# Altium schematic sheet IO.SchDoc
size A4; SheetNumber: 2; SheetTotal: 7
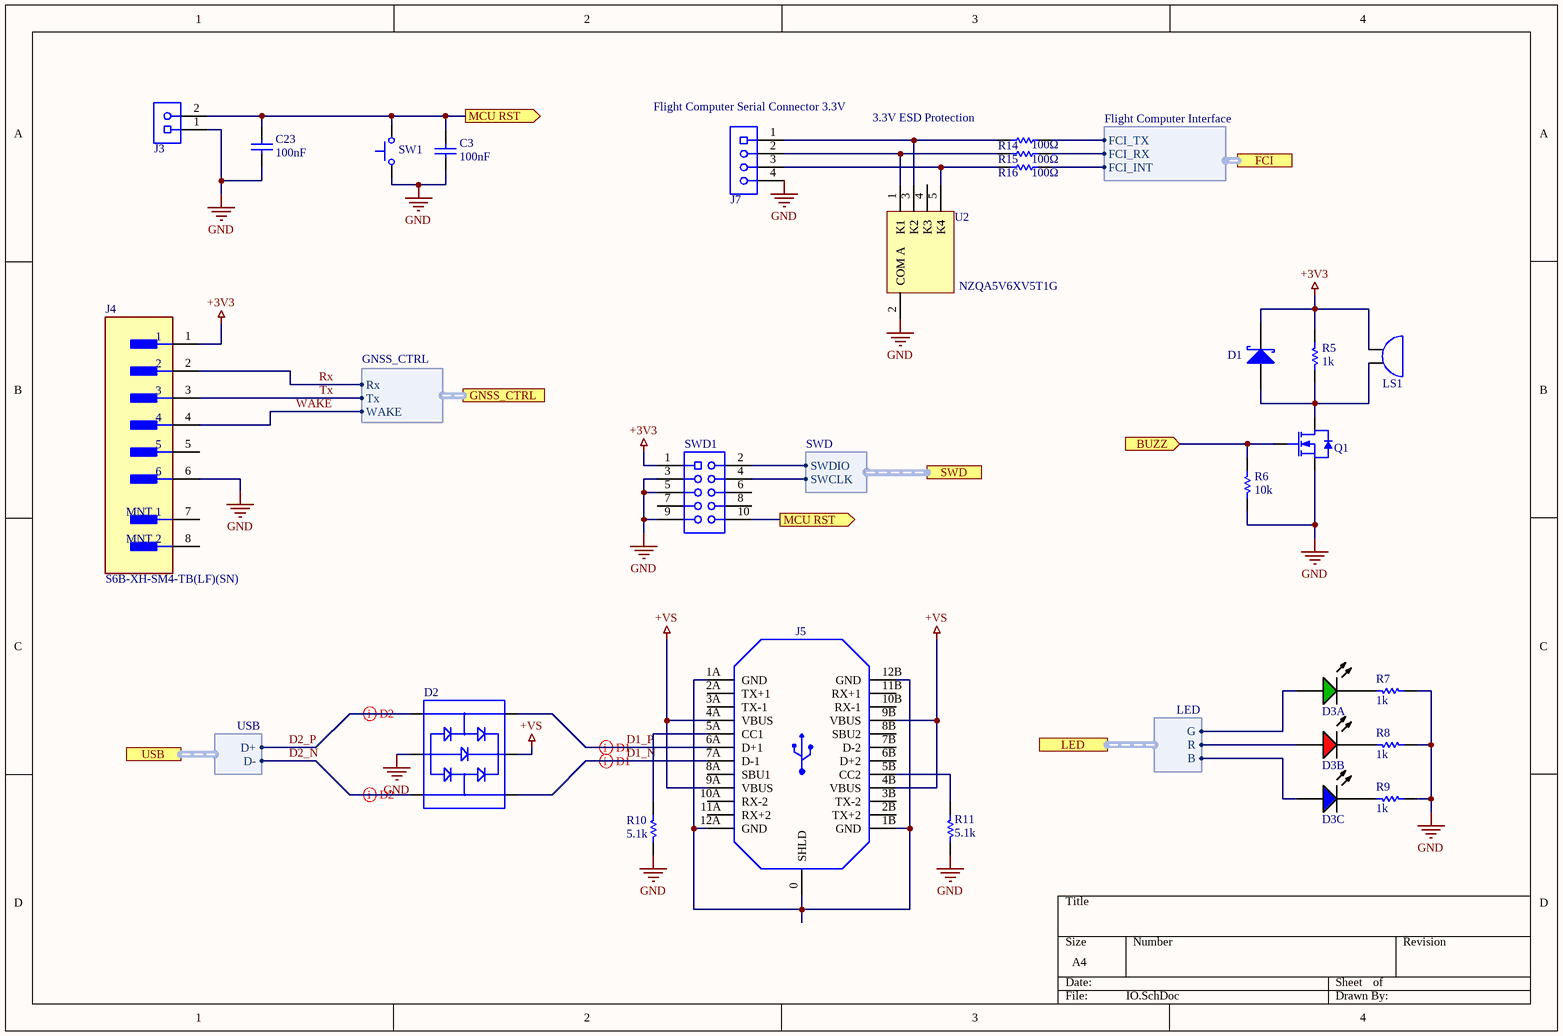
[diagram p0: IO.SchDoc]

## Parts
C3  value 100nF  [CAPC1608X10N]  (hidden comment: C0603C104M5RACTU)
C23  value 100nF  [CAPC1608X10N]  (hidden comment: C0603C104M5RACTU)
D1  RB521S30T1G  [SODFL160X70-2N]  (value not drawn)
D2  USBLC6-2SC6  [USBLC6-2SC6-Footprint-1]  (value not drawn)
D3  LRTBGVSR-U4V2-JW+A6BB-D8+S2U2-7Z-20-S  [LRTBGVSG-UEVE-24+AMAQ-29+SCUC-HR-Footprint-1]  (value not drawn)  (parts A,B,C of 3)
J3  22-28-4020  [22-28-4020-Footprint-1]  (value not drawn)
J4  S6B-XH-SM4-TB(LF)(SN)  [FP-S6B-XH-SM4-TB_LF_SN-MFG]
J5  SS-52400-003  [SS-52400-003-Footprint-1]  (value not drawn)
J7  53426-0410  [53426-0410-Footprint-1]  (value not drawn)
LS1  CMT-8503-85B-SMT-TR  [CMT-8503-85B-SMT-TR-Footprint-1]  (value not drawn)
Q1  2N7002NXAKR  [SOT95P230X110-3N]  (value not drawn)
R5  value 1k  [RESC1608X06N]  (hidden comment: CRCW06031K00FKEA)
R6  value 10k  [RESC1608X06N]  (hidden comment: CRCW060310K0FKEA)
R7  value 1k  [RESC1608X06N]  (hidden comment: CRCW06031K00FKEA)
R8  value 1k  [RESC1608X06N]  (hidden comment: CRCW06031K00FKEA)
R9  value 1k  [RESC1608X06N]  (hidden comment: CRCW06031K00FKEA)
R10  value 5.1k  [RESC1608X06N]  (hidden comment: CRCW06035K10FKEA)
R11  value 5.1k  [RESC1608X06N]  (hidden comment: CRCW06035K10FKEA)
R14  100Ω  [RESC1609X50X30ML8T20]
R15  100Ω  [RESC1609X50X30ML8T20]
R16  100Ω  [RESC1609X50X30ML8T20]
SW1  B3U-1000P  [OMRON-B3U-1000_V]  (value not drawn)
SWD1  M22-2520505  [M22-2520505-Footprint-1]  (value not drawn)
U2  NZQA5V6XV5T1G  [ONSC-SOT-553-5-463B_B_V]

## Ports
BUZZ (in, see Top Level[4C], Flight_Computer[3C]), FCI (harness Flight Computer Interface, see Top Level[4C], Flight_Computer[4C]), GNSS_CTRL (harness GNSS_CTRL, see Top Level[4D], Flight_Computer[1B]), LED (harness LED, see Top Level[4C], Flight_Computer[4A]), MCU RST (out, see Top Level[4C], Flight_Computer[2B]), SWD (harness SWD, see Top Level[4B], Flight_Computer[3B]), USB (harness USB, see Top Level[4C], Flight_Computer[3C])

## Harnesses
USB: D+, D-
SWD: SWDIO, SWCLK
LED: R, G, B
Flight Computer Interface: FCI_TX, FCI_RX, FCI_INT
GNSS_CTRL: Rx, Tx, WAKE

## Nets
+3V3: D1.1(K) J4.1 LS1.1 R5.2 SWD1.1(VDD)
+VS: D2.5 J5.4A(VBUS) J5.4B(VBUS) J5.9A(VBUS) J5.9B(VBUS)
GND: C3.1 C23.1 D2.2 J3.1 J4.6 J7.4 Q1.2(S) R6.1 R7.2 R8.2 R9.2 R10.1 R11.1 SW1.2 SWD1.3(GND) SWD1.5(GND) SWD1.9(GND) U2.2(COM_A)
BUZZ: Q1.1(G) R6.2 ; port BUZZ
D1_N: D2.6 J5.7A(D-1)
D1_P: D2.4 J5.6A(D+1)
D2_N: D2.1 ; port USB.D-
D2_P: D2.3 ; port USB.D+
MCU RST: C3.2 C23.2 J3.2 SW1.1 SWD1.10(NRST) ; port MCU RST
Rx: J4.2 ; port GNSS_CTRL.Rx
Tx: J4.3 ; port GNSS_CTRL.Tx
WAKE: J4.4 ; port GNSS_CTRL.WAKE
NetD1_2: D1.2(A) LS1.2 Q1.3(D) R5.1
NetD3_1: D3.1(K1) R7.1
NetD3_2: D3.2(A3) ; port LED.B
NetD3_3: D3.3(K3) R9.1
NetD3_4: D3.4(K2) R8.1
NetD3_5: D3.5(A2) ; port LED.R
NetD3_6: D3.6(A1) ; port LED.G
NetJ5_0: J5.0(SHLD) J5.1A(GND) J5.1B(GND) J5.12A(GND) J5.12B(GND)
NetJ5_5A: J5.5A(CC1) R10.2
NetJ5_5B: J5.5B(CC2) R11.2
NetJ7_1: J7.1 R14.2 U2.3(K2)
NetJ7_2: J7.2 R15.2 U2.1(K1)
NetJ7_3: J7.3 R16.2 U2.5(K4)
NetR14_1: R14.1 ; port FCI.FCI_TX
NetR15_1: R15.1 ; port FCI.FCI_RX
NetR16_1: R16.1 ; port FCI.FCI_INT
NetSWD1_2: SWD1.2(SWDIO) ; port SWD.SWDIO
NetSWD1_4: SWD1.4(SWCLK) ; port SWD.SWCLK

Not connected (* = marked no-connect by the designer): J4 5 7(MNT_1) 8(MNT_2); J5 2A(TX+1) 2B(TX+2) 3A(TX-1) 3B(TX-2) 6B(D+2) 7B(D-2) 8A(SBU1) 8B(SBU2) 10A(RX-2) 10B(RX-1) 11A(RX+2) 11B(RX+1); SWD1 6(SWO) 7(NC) 8(NC); U2 4(K3)

## Layout directives
differential pair: D1_N, D1_P, D2_N, D2_P

## Notes on the sheet
- (near J7) Flight Computer Serial Connector 3.3V
- 3.3V ESD Protection

## Library data of the parts
C3 C23 = CMP-00038-5: Cap Ceramic 0.1uF 50V X7R 20% SMD 0603 125C T/R; Dissipation Factor: 2.5%; Min Operating Temperature: -55°C; Contact Plating: Tin,Matte; Height: 0.8mm; Voltage Rating: 50V; REACH SVHC: No SVHC; Max Operating Temperature: 125°C; Termination: SMD/SMT; Package Quantity: 1; Capacitance: 100nF; Packaging: Tape and Reel; Width: 0.031inch; Depth: 0.8mm; Dielectric: X7R; Tolerance: 20%; Lead Pitch: 0.7mm; Thickness: 0.034inch; Length: 1.6mm; Dielectric Material: Ceramic; Radiation Hardening: No; Voltage Rating (DC): 50V; Case/Package: 0603; Case Code (Metric): 1608; Mount: Surface Mount,PCB; Case Code (Imperial): 0603; JLC_PN: C14663
D1 = CMP-00227-2: ON SEMICONDUCTOR - RB521S30T1G - Small Signal Schottky Diode, Single, 30 V, 200 mA, 500 mV, 1 A, 125 °C; Max Surge Current: 1A; Power Dissipation: 200mW; Forward Voltage: 500mV; Max Reverse Voltage (DC): 30V; Forward Current: 200mA; Polarity: Standard; Max Reverse Current: 30uA; Width: 0.9mm; Min Operating Temperature: -55°C; Radiation Hardening: No; Peak Non-Repetitive Surge Current: 1A; REACH SVHC: No SVHC; Height: 0.7mm; Case/Package: SOD-523-2; Lead Free: Lead Free; Voltage Rating (DC): 30V; Package Quantity: 1; Current Rating: 200mA; Output Current: 200mA; Number of Pins: 2; Max Reverse Leakage Current: 30uA; Max Repetitive Reverse Voltage (Vrrm): 30V; Length: 1.3mm; Contact Plating: Tin,Matte; Max Forward Surge Current (Ifsm): 1A; Max Operating Temperature: 125°C; Element Configuration: Single; Packaging: Tape and Reel; Average Rectified Current: 200mA; RoHS Compliant: Yes
D2 = CMP-00283-1: USB ESD Supressor TVS DIODE 5.25V 17V SOT23-6; Capacitance: 3.5pF; Leakage Current: 150nA; Polarity: Unidirectional,Bidirectional; Min Breakdown Voltage: 6V; Number of Channels: 2; Test Current: 1mA; Data Rate: 480Mbps; Number of Elements: 1; Operating Supply Voltage: 1.1V; ESD Protection: Yes; Working Voltage: 5V; Peak Pulse Current: 5A; Element Configuration: Dual; Contact Plating: Tin,Matte; Reverse Standoff Voltage: 5.25V; Number of Pins: 6; Number of Bidirectional Channels: 2; Radiation Hardening: No; REACH SVHC: No SVHC; Series: USB; Clamping Voltage: 17V; Direction: Unidirectional,Bidirectional; Case/Package: SOT-23; Lead Free: Lead Free; RoHS Compliant: Yes; Min Operating Temperature: -40°C; Mount: Surface Mount; Clamping Voltage-Max: 17V; Depth: 1.75mm; Max Breakdown Voltage: 6V; Height: 1.3mm; Package Quantity: 3000; Width: 1.75mm; Termination: SMD/SMT; Reverse Breakdown Voltage: 6V; Packaging: Tape and Reel; Max Reverse Leakage Current: 150nA; Length: 3.05mm; Max Operating Temperature: 125°C; Breakdown Voltage: 6V; Power Line Protection: Yes
D3 = CMP-00027-2: LED Multicolor Red/True Green/Blue 626nm/528nm/465nm 40mA/50mA/50mA 6-Pin SMD T/R
J3 = CMP-00157-4: KK 254 Breakaway Header, Vertical, 2 Circuits, Tin (Sn) Plating, Mating Pin Length 6.09mm 2 POS; Number of Positions: 2; Voltage Rating (DC): 250V; Contact Resistance: 20mR; Gender: Male; Connector Type: Male Pin; Glow Wire Compliant: Non-compliant; Pitch: 2.54mm; Current Rating: 4A; Orientation: Straight; Flammability Rating: UL94 V-0; Termination: Solder; Mount: Through Hole; Housing Color: Black; Contact Mating Length: 0.24inch; Min Operating Temperature: 0°C; Package Quantity: 1; Color: Black; Voltage Rating: 250V; REACH SVHC: Unknown; Contact Plating: Tin; Packaging: Bulk; Max Voltage Rating (DC): 250V; Max Operating Temperature: 75°C; Number of Circuits: 2; Housing Material: Nylon; Number of Contacts: 2; Lead Free: Lead Free; Radiation Hardening: No; Number of Rows: 1; Contact Material: Brass,Bronze; Mounting Technology: Through Hole; Depth: 2.49mm; Max Voltage Rating (AC): 250V; Series: KK® 42375; Contact Type: Male Pin
J4 = CMP-17439-000164-1: CONN HEADER SMD R/A 6POS 2.5MM; Gender: Male; Number of Positions: 6; Max Current Rating: 3A; Voltage Rating: 250V; Contact Resistance: 20mR; Flammability Rating: UL94 V-0; Orientation: Right Angle; Contact Finish - Mating: TIN; Packaging: Tape and Reel; Termination: Solder; Pitch: 2.5mm; Housing Color: Beige; Insulation Material: Nylon; Fastening Type: Detent; Housing Material: Polyamide; Package Quantity: 1; Mount: Surface Mount; Insulation Color: Natural; Series: XH; Depth: 7mm; Contact Shape: Square; Color: Natural; Max Voltage Rating (AC): 250V; Min Operating Temperature: -25°C; Number of Contacts: 6; Lead Free: Lead Free; Contact Material: Copper Alloy; Contact Type: Male Pin; Length: 20mm; Max Operating Temperature: 85°C; Connector Type: Header; Number of Rows: 1; REACH SVHC: No SVHC; Contact Plating: Copper
J5 = CMP-00209-1: USB Type-C Receptacle for 1.60mm PCB
J7 = CMP-00280-1: 2.50mm Pitch Mini-Lock™ Wire-to-Board Header, Right Angle, Friction and Positive Lock, 4 Circuits; Gender: Male; Current Rating: 3A; Pitch: 2.5mm; Number of Positions: 4; Glow Wire Compliant: Non-compliant; Contact Resistance: 20mR; Voltage Rating: 250V; Packaging: Tray; Min Operating Temperature: -40°C; Number of Rows: 1; Case/Package: 0410; Housing Material: Polyester; Orientation: Right Angle; Color: White; Series: 53426; Contact Material: Bronze; Radiation Hardening: No; Number of Circuits: 4; REACH SVHC: No SVHC; Number of Contacts: 4; Contact Plating: Tin; Package Quantity: 1000; Termination: Through Hole; Max Operating Temperature: 105°C; Contact Gender: Male; Mount: Through Hole; RoHS Compliant: Yes
LS1 = CMP-00287-1: 8.5 mm, 3.6 Vo-p, 85 dB, Surface Mount (SMT), Magnetic Audio Transducer Buzzer
Q1 = CMP-00122-3: 2N7002NXAK - 60 V, single N-channel Trench MOSFET; JLC_PN: C8545
R5 R7-R9 = CMP-00041-3: VISHAY - CRCW06031K00FKEA - SMD Chip Resistor, 0603 [1608 Metric], 1 kohm, CRCW e3 Series, 75 V, Thick Film, 100 mW; Power Rating: 100mW; Resistance: 1kR; Temperature Coefficient: 100ppm/°C; Voltage Rating (DC): 75V; Tolerance: 1%; Case Code (Imperial): 0603; Packaging: Tape and Reel; Composition: Thick Film; Min Operating Temperature: -55°C; Length: 1.55mm; Radiation Hardening: No; Number of Terminations: 2; Contact Plating: Tin; Features: Automotive AEC-Q200; Height: 0.45mm; Max Operating Temperature: 155°C; Termination: SMD/SMT; Package Quantity: 10; Case/Package: 0603; Lead Free: Lead Free; Case Code (Metric): 1608; Width: 0.033inch; Weight: 7.1E-05oz; Mount: Surface Mount; REACH SVHC: Unknown; Number of Pins: 2; Max Power Dissipation: 100mW; Depth: 0.85mm; Voltage Rating: 75V; Military Standard: Not; JLC_PN: C21190
R6 = CMP-00042-5: VISHAY - CRCW060310K0FKEA - SMD Chip Resistor, 0603 [1608 Metric], 10 kohm, CRCW e3 Series, 75 V, Thick Film, 100 mW; Voltage Rating: 75V; Temperature Coefficient: 100ppm/°C; Resistance: 10kR; Power Rating: 100mW; Tolerance: 1%; Number of Terminations: 2; Termination: SMD/SMT; Weight: 7.1E-05oz; Contact Plating: Tin,Lead; Max Operating Temperature: 155°C; Voltage Rating (DC): 75V; Military Standard: Not; Min Operating Temperature: -55°C; Depth: 0.85mm; Lead Free: Lead Free; Width: 0.033inch; Max Power Dissipation: 100mW; Features: Automotive AEC-Q200; Number of Pins: 2; Package Quantity: 10; Case/Package: 0603; Height: 0.45mm; Radiation Hardening: No; REACH SVHC: Unknown; Packaging: Tape and Reel; Length: 1.55mm; Case Code (Metric): 1608; Case Code (Imperial): 0603; Composition: Thick Film; JLC_PN: C25804
R10 R11 = CMP-00220-2: Res Thick Film 0603 5.1K Ohm 1% 1/10W ±100ppm/°C Molded SMD SMD Paper T/R; Power Rating: 100mW; Voltage Rating (DC): 75V; Case/Package: 0603; Max Operating Temperature: 155°C; Features: Automotive AEC-Q200; Height: 0.45mm; Series: CRCW; JLC_PN: C23186; Max Power Dissipation: 100mW; Radiation Hardening: No; Depth: 0.85mm; Technology: THICK FILM; Reach SVHC Compliant: Unknown; Package Quantity: 5000; Contact Plating: Tin; Case Code (Metric): 1608; Lead Free: Lead Free; Military Standard: Not; Tolerance: 1%; Resistor Type: Thick Film; Weight: 7.1E-05oz; Resistance Tolerance: 1%; Temperature Coefficient: 100ppm/°C; Termination: SMD/SMT; Min Operating Temperature: -55°C; Construction: Rectangular; RoHS Compliant: Yes; Packaging: Tape and Reel; Number of Terminations: 2; Width: 0.85mm; Voltage Rating: 75V; Case Code (Imperial): 0603; Length: 1.55mm
R14-R16 = CMP-2000-03824-5: Chip Resistor, 100 Ohm, +/- 1%, 100 mW,-55 to 155 degC, 0603 (1608 Metric), RoHS, Tape and Ree; Manufacturer: Vishay Semiconductor; ComponentLink2URL: http://www.vishay.com/docs/20035/dcrcwe3.pdf; ComponentLink1URL: http://www.vishay.com/; Mounting Technology: Surface Mount; ComponentLink1Description: Manufacturer URL; ComponentLink2Description: Datasheet; PackageDescription: 2-Pin Surface Mount Device, Body 1.575 x 0.85 mm; PackageReference: 0603; DatasheetVersion: 06/2012
SW1 = CMP-00028-1: SWITCH TACTILE SPST-NO 0.05A 12V; Actuator Length: 0.4mm; Contact Resistance: 100mR; Mechanical Life: 200000Cycles; Contact Current Rating: 50mA; Illumination Type: Non-Illuminated,Illuminated; Actuator Type: Standard; Ratings: Dust Proof,IP40; Switch Travel: 0.15mm; Throw Configuration: SPST; Operating Force: 1.5N; Switch Function: Off-Mom; Width: 3mm; REACH SVHC: Unknown; Max Voltage Rating (DC): 12V; Packaging: Tape and Reel; Mount: Surface Mount; Max Operating Temperature: 70°C; Min Operating Temperature: -25°C; Length: 4mm; Depth: 2.5mm; Termination: SMD/SMT; Contact Material: Silver; Weight: 0.000776oz; Current Rating: 50mA; Package Quantity: 1; Max Current Rating: 50mA; Lead Free: Lead Free; Voltage Rating (DC): 12V; Electrical Life: 200000Cycles; Insulation Resistance: 100MR; Orientation: Straight; Height: 1.2mm
SWD1 = CMP-00022-1: CONN HEADER 2MM VERT AU 10POS; Contact Resistance: 20mR; Gender: Male; Number of Positions: 10; Row Spacing: 0.079inch; Voltage Rating: 650V; Connector Type: Male Pin; Current Rating: 1A; Package Quantity: 500; Length: 10mm; Packaging: Bulk; Max Operating Temperature: 105°C; Number of Rows: 2; Contact Material: Bronze; Min Operating Temperature: -55°C; Color: Black; Mount: Through Hole; Contact Plating: Gold; REACH SVHC: No SVHC; Depth: 4mm; Radiation Hardening: No; Termination: Solder; Number of Contacts: 10; Orientation: Straight; Pitch: 2mm; Housing Material: Nylon; Contact Mating Length: 0.138inch; Housing Color: Black; Max Current Rating: 1A
U2 = CMP-1063-00192-1: Quad Array for ESD Protection, 5-Pin SOT-553, Pb-Free, Tape and Reel; Manufacturer: On Semiconductor; V(BR) Min (V): 5.32; C Max (pF): 90; Number of Lines: 4; VRWM Max (V): 3; IR Max (uA): 1; PPK Max (W): 100; Direction: Unidirectional; ComponentLink1Description: Manufacturer URL; ComponentLink1URL: http://www.onsemi.com/; DatasheetVersion: Rev. 3; ComponentLink3URL: http://www.onsemi.com/pub_link/Collateral/NZQA5V6AXV5%20SERIES-D.PDF; ComponentLink2URL: http://www.onsemi.com/pub_link/Collateral/NZQA5V6XV5T1-D.PDF; PackageReference: SOT-553-5-463B_B; PartNumber: NZQA5V6XV5T1G; PackageVersion: Rev. B, 05/2005; ComponentLink2Description: Datasheet; Packing: Tape and Reel; PackageDescription: 5-Pin Small Outline Transistor, Body 1.6 x 1.2 mm, Pitch 0.5 mm; ComponentLink3Description: Package Specification; Mounting Technology: Surface Mount; RoHS: Pb-Free